# EAGLE schematic pulseox-v1 (EAGLE 6.5.0)
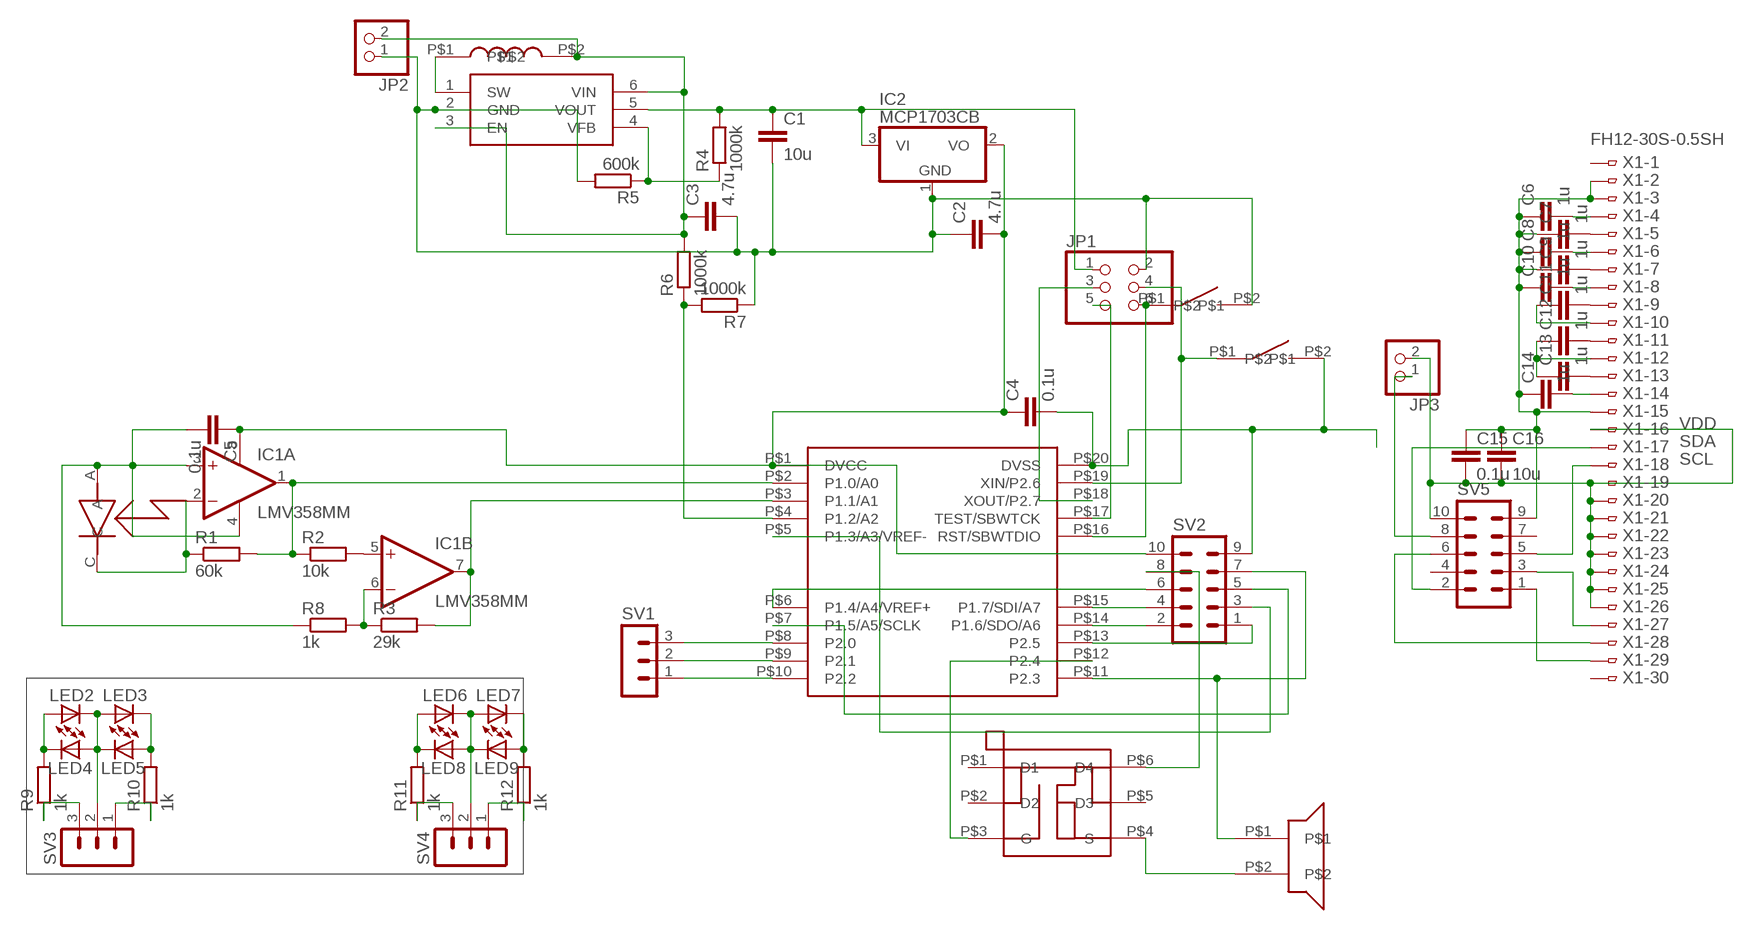
[diagram p0: schematic, sheet 1]

## Parts
C1  10u  C-EUC0603K  [C0603K]
C2  4.7u  C-EUC0603K  [C0603K]
C3  4.7u  C-EUC0603K  [C0603K]
C4  0.1u  C-EUC0603K  [C0603K]
C5  0.1u  C-EUC0603K  [C0603K]
C6  1u  C-EUC0603K  [C0603K]
C7  1u  C-EUC0603K  [C0603K]
C8  1u  C-EUC0603K  [C0603K]
C9  1u  C-EUC0603K  [C0603K]
C10  1u  C-EUC0603K  [C0603K]
C11  1u  C-EUC0603K  [C0603K]
C12  1u  C-EUC0603K  [C0603K]
C13  1u  C-EUC0603K  [C0603K]
C14  1u  C-EUC0603K  [C0603K]
C15  0.1u  C-EUC0603K  [C0603K]
C16  10u  C-EUC0603K  [C0603K]
IC1  LMV358MM  [MSOP08]
IC2  MCP1703CB  [SOT23]
JP1  PINHD-2X3  [2X03]
JP2  PINHD-1X2  [1X02]
JP3  PINHD-1X2  [1X02]
LED1  QSB34ZR  [R-PLCC2]
LED2  LEDCHIP-LED0603  [CHIP-LED0603]
LED3  LEDCHIP-LED0603  [CHIP-LED0603]
LED4  LEDCHIP-LED0603  [CHIP-LED0603]
LED5  LEDCHIP-LED0603  [CHIP-LED0603]
LED6  LEDCHIP-LED0603  [CHIP-LED0603]
LED7  LEDCHIP-LED0603  [CHIP-LED0603]
LED8  LEDCHIP-LED0603  [CHIP-LED0603]
LED9  LEDCHIP-LED0603  [CHIP-LED0603]
R1  60k  R-EU_R0603  [R0603]
R2  10k  R-EU_R0603  [R0603]
R3  29k  R-EU_R0603  [R0603]
R4  1000k  R-EU_R0603  [R0603]
R5  600k  R-EU_R0603  [R0603]
R6  1000k  R-EU_R0603  [R0603]
R7  1000k  R-EU_R0603  [R0603]
R8  1k  R-EU_R0603  [R0603]
R9  1k  R-EU_R0603  [R0603]
R10  1k  R-EU_R0603  [R0603]
R11  1k  R-EU_R0603  [R0603]
R12  1k  R-EU_R0603  [R0603]
SV1  MA03-1  [MA03-1]
SV2  MA05-2  [MA05-2]
SV3  MA03-1  [MA03-1]
SV4  MA03-1  [MA03-1]
SV5  MA05-2  [MA05-2]
U$1  MSP430G2452IPW20  [TSSOP-20]
U$2  MCP1640SOT23-6  [SOT23-6L]
U$3  WE-TPC  [WE-TPC]
U$4  BSD816SN  [SOT363]
U$5  FSMSM  [FSMSM]
U$6  FSMSM  [FSMSM]
U$7  AT-2440-TWT-R  [AT-2440-TWT-R]
X1  FH12-30S-0.5SH  [FH12-30S-0.5SH]

## Nets
3V: C2.2 C4.1 C5.1 IC1.8(P:V+) IC2.2(VO) SV2.10 U$1.P$1(DVCC)
GND: C1.2 C2.1 C3.2 C4.2 C5.2 IC1.3(A:+IN) IC1.4(P:V-) IC2.1(GND) JP1.2 JP2.1 LED1.A R5.2 R7.1 R8.1 SV2.9 U$1.P$20(DVSS) U$2.2(GND) U$4.P$4(S) U$5.P$2 U$6.P$2 U$7.P$2
N$1: IC1.2(A:-IN) LED1.C R1.1
N$2: SV2.4 U$1.P$15(P1.7/SDI/A7)
N$3: IC1.1(A:OUT) R1.2 R2.1 U$1.P$2(P1.0/A0)
N$4: IC1.5(B:+IN) R2.2
N$5: IC1.6(B:-IN) R3.1 R8.2
N$6: IC1.7(B:OUT) R3.2 U$1.P$3(P1.1/A1)
N$7: SV2.2 U$1.P$14(P1.6/SDO/A6)
N$8: C1.1 IC2.3(VI) JP1.1 R4.2 U$2.5(VOUT)
N$9: U$2.1(SW) U$3.P$1
N$10: R4.1 R5.1 U$2.4(VFB)
N$11: C3.1 JP2.2 R6.2 U$2.3(EN) U$2.6(VIN) U$3.P$2
N$12: SV1.1 U$1.P$10(P2.2)
N$13: SV1.2 U$1.P$9(P2.1)
N$14: SV1.3 U$1.P$8(P2.0)
N$15: R6.1 R7.2 U$1.P$4(P1.2/A2)
N$16: SV2.1 U$1.P$13(P2.5)
N$17: U$1.P$12(P2.4) U$4.P$3(G)
N$18: SV2.7 U$1.P$11(P2.3) U$7.P$1
N$19: SV2.3 U$1.P$5(P1.3/A3/VREF-)
N$20: SV2.6 U$1.P$6(P1.4/A4/VREF+)
N$21: SV2.5 U$1.P$7(P1.5/A5/SCLK)
N$22: SV2.8 U$4.P$6(D4)
N$23: LED2.C LED3.A LED4.A LED5.C SV3.2
N$24: LED2.A LED4.C R9.2
N$25: LED3.C LED5.A R10.2
N$26: R9.1 SV3.3
N$27: R10.1 SV3.1
N$28: LED6.C LED7.A LED8.A LED9.C SV4.2
N$29: LED7.C LED9.A R12.2
N$30: LED6.A LED8.C R11.2
N$31: JP1.4 U$1.P$19(XIN/P2.6) U$6.P$1
N$32: R11.1 SV4.3
N$33: R12.1 SV4.1
N$34: JP1.3 U$1.P$18(XOUT/P2.7)
N$35: JP1.5 U$1.P$17(TEST/SBWTCK)
N$36: JP1.6 U$1.P$16(RST/SBWTDIO) U$5.P$1
N$37: SV5.5 X1.18
N$38: C7.2 X1.5
N$39: C9.2 X1.7
N$40: C6.2 X1.4
N$41: C8.2 X1.6
N$42: C10.2 X1.8
N$43: C6.1 C7.1 C8.1 C9.1 C10.1 C14.1 C15.1 C16.1 SV5.9 X1.2 X1.3 X1.15
N$44: C11.2 X1.9
N$45: C11.1 X1.10
N$46: C12.2 X1.11
N$47: C13.2 X1.13
N$48: C12.1 C13.1 X1.12
N$49: C14.2 X1.14
N$50: C15.2 C16.2 JP3.2 SV5.10 X1.16 X1.19 X1.20 X1.21 X1.22 X1.23 X1.24 X1.25 X1.26
N$51: SV5.2 X1.17
N$52: SV5.1 X1.29
N$53: SV5.6 X1.28
N$54: SV5.3 X1.27
N$56: JP3.1 SV5.8
Unconnected: SV5.4 SV5.7 U$4.P$1(D1) U$4.P$2(D2) U$4.P$5(D3) X1.1 X1.30

## Notes on the sheet
- VDD
- SDA
- SCL

## Library data of the parts
C1-C16 = rcl:C-EU: CAPACITOR, European symbol
IC1 = linear:LMV358?*: Dual General Purpose, Low Voltage, Rail-to-Rail Output Operational Amplifiers Source: http://www.national.com/mpf/LM/LMV321.html http://www.national.com/dt/lmv_qual.pdf
IC2 = linear:MCP1703: 250 mA, 16V, Low Quiescent Current LDO Regulator Source: http://ww1.microchip.com/downloads/en/DeviceDoc/22049b.pdf
JP1 = pinhead:PINHD-2X3: PIN HEADER
JP2 JP3 = pinhead:PINHD-1X2: PIN HEADER
LED1 = pulseoxparts:QSB34ZR
LED2-LED9 = led:LED: LED OSRAM: - CHIPLED LG R971, LG N971, LY N971, LG Q971, LY Q971, LO R971, LY R971 LH N974, LH R974 LS Q976, LO Q976, LY Q976 LO Q996 - Hyper CHIPLED LW Q18S LB Q993, LB Q99A, LB R99A - SideLED LS A670, LO A670, LY A670, LG A670, LP A670 LB A673, LV A673, LT A673, LW A673 LH A674 LY A675 LS A676, LA A676, LO A676, LY A676, LW A676 LS A679, LY A679, LG A679 - Hyper Micro SIDELED® LS Y876, LA Y876, LO Y876, LY Y876 LT Y87S - SmartLED LW L88C, LW L88S LB L89C, LB L89S, LG L890 LS L89K, LO L89K, LY L89K LS L896, LA L896, LO L896, LY L896 - TOPLED LS T670, LO T670, LY T670, LG T670, LP T670 LSG T670, LSP T670, LSY T670, LOP T670, LYG T670 LG T671, LOG T671, LSG T671 LB T673, LV T673, LT T673, LW T673 LH T674 LS T676, LA T676, LO T676, LY T676, LB T676, LH T676, LSB T676, LW T676 LB T67C, LV T67C, LT T67C, LS T67K, LO T67K, LY T67K, LW E67C LS E67B, LA E67B, LO E67B, LY E67B, LB E67C, LV E67C, LT E67C LW T67C LS T679, LY T679, LG T679 LS T770, LO T770, LY T770, LG T770, LP T770 LB T773, LV T773, LT T773, LW T773 LH T774 LS E675, LA E675, LY E675, LS T675 LS T776, LA T776, LO T776, LY T776, LB T776 LHGB T686 LT T68C, LB T68C - Hyper Mini TOPLED® LB M676 - Mini TOPLED Santana® LG M470 LS M47K, LO M47K, LY M47K Source: http://www.osram.convergy.de LUXEON: - LUMILED® LXK2-PW12-R00, LXK2-PW12-S00, LXK2-PW14-U00, LXK2-PW14-V00 LXK2-PM12-R00, LXK2-PM12-S00, LXK2-PM14-U00 LXK2-PE12-Q00, LXK2-PE12-R00, LXK2-PE12-S00, LXK2-PE14-T00, LXK2-PE14-U00 LXK2-PB12-K00, LXK2-PB12-L00, LXK2-PB12-M00, LXK2-PB14-N00, LXK2-PB14-P00, LXK2-PB14-Q00 LXK2-PR12-L00, LXK2-PR12-M00, LXK2-PR14-Q00, LXK2-PR14-R00 LXK2-PD12-Q00, LXK2-PD12-R00, LXK2-PD12-S00 LXK2-PH12-R00, LXK2-PH12-S00 LXK2-PL12-P00, LXK2-PL12-Q00, LXK2-PL12-R00 Source: www.luxeon.com KINGBRIGHT: KA-3528ASYC Source: www.kingbright.com
R1-R12 = rcl:R-EU_: RESISTOR, European symbol
SV1 SV3 SV4 = con-lstb:MA03-1: PIN HEADER; OC_FARNELL: unknown; OC_NEWARK: unknown
SV2 SV5 = con-lstb:MA05-2: PIN HEADER; OC_FARNELL: unknown; OC_NEWARK: unknown
U$1 = pulseoxparts:MSP430G2452IPW20
U$2 = motiondet:MCP1640
U$3 = pulseoxparts:WE-TPC
U$4 = untitled:BSD816SN
U$5 U$6 = untitled:FSMSM
U$7 = pulseoxparts:AT-2440-TWT-R
X1 = con-hirose:FH12-30S-0.5S: 0.5mm Pitch Connectors For FPC/FFC Source: Data sheet <http://www.hirose.co.jp/cataloge_hp/e58605370.pdf>; MPN: FH12-30S-0.5SH(55); OC_FARNELL: 1324555; OC_NEWARK: 34M6176